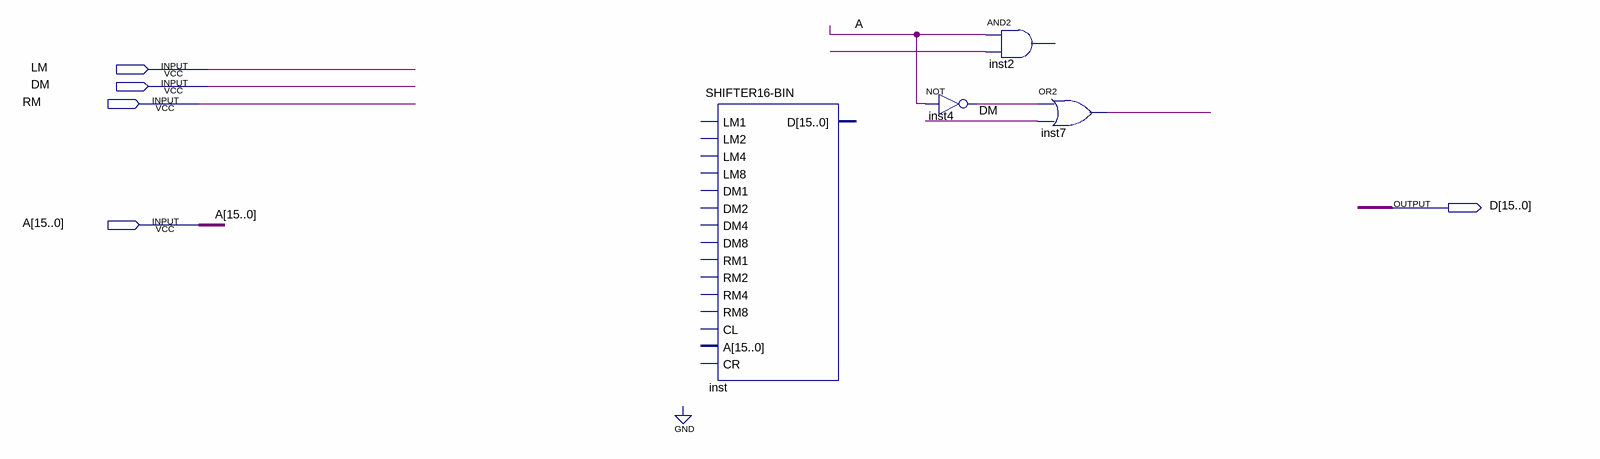
[diagram p0: schematic sheet]
// Quartus schematic SH-TST.bdf as structural Verilog: 4 symbols, 5 pins
module \SH-TST  (
  input  LM,
  input  DM,
  input  RM,
  input  [15:0] A,
  output [15:0] D
);

  wire A_1bit, inst4_out, inst7_out, undriven;

  \SHIFTER16-BIN  inst ();  // open: LM1, LM2, LM4, LM8, DM1, DM2, DM4, DM8, RM1, RM2, RM4, RM8, CL, A, CR, D
  // AND2 inst2 has open pins: IN1=A_1bit, IN2=undriven, OUT=open
  not inst4 (inst4_out, A_1bit);
  or inst7 (inst7_out, inst4_out, DM);
endmodule
